# Altium schematic sheet SDcard.SchDoc: Thymio2
size A4; Organization: Original design LSRO-STI-EPFL; Address1: Association Mobsya; Address2: Michael Bonani; Address3: Ch. Closel 3; Address4: CH-1020 Renens; DocumentNumber: 9; Revision: 2.3; SheetNumber: 9; SheetTotal: 9; Engineer: Michael Bonani; Title2: PCB principal; ProjectName: Name of the project
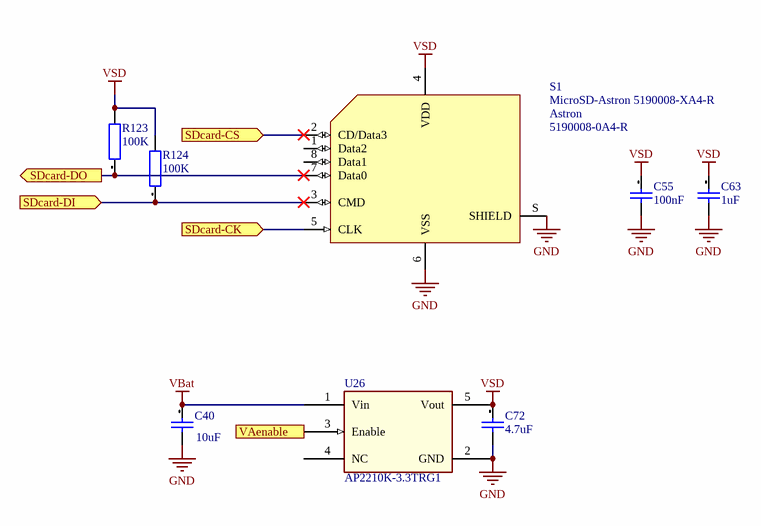
[diagram p0: SDcard.SchDoc]

## Parts
C40  10uF  [CAPC1005X05N]
C55  100nF  [CAPC1005X05N]
C63  1uF  [CAPC1005X05N]
C72  4.7uF  [CAPC1005X05N]
R123  100K  [RESC1005X04N]
R124  100K  [RESC1005X04N]
S1  MicroSD-Astron 5190008-XA4-R  Manufacturer: Astron  MFG Part Number: 5190008-0A4-R  [Astron 5190008-XA4-R]
U26  AP2210K-3.3TRG1  [SOT95P285X100-5N]

## Ports
SDcard-CK (in), SDcard-CS (in), SDcard-DI (in), SDcard-DO (out), VAenable (in)

## Nets
GND: C40.2 C55.2 C63.2 C72.2 S1.6(VSS) S1.S(SHIELD) U26.2(GND)
VBat: C40.1 U26.1(Vin)
VSD: C55.1 C63.1 C72.1 R123.2 R124.2 S1.4(VDD) U26.5(Vout)
SDcard-CK: S1.5(CLK) ; port SDcard-CK
SDcard-CS: S1.2(CD/Data3) ; port SDcard-CS
SDcard-DI: R124.1 S1.3(CMD) ; port SDcard-DI
SDcard-DO: R123.1 S1.7(Data0) ; port SDcard-DO
VAenable: U26.3(Enable) ; port VAenable

Not connected (* = marked no-connect by the designer): S1 1(Data2) 8(Data1); U26 4(NC)

## Notes on the sheet
- Date:
- Project
- Part
- Revision:
- File :
- Page
- de

## Library data of the parts
C40 C72 = 4.7uF[[/\]]0603[[/\]]1: Capacitor; Manufacturer: Kemet; Manufacturer Nr: C0603C475K9PAC; Preference: 1; Tolerance +: +10; Tolerance -: -10; Dielectric: X5R; Voltage: 6.3; MaxTemperature: +85; MinTemperature: -55; Quant_1: 10; Quant_2: 100; Quant_3: 1000; Quant_4: 4000; Currentie: CHF; LayerSch: Top; Size: 0603; Footprint Acort: 0603_G; Supplier: Farnell; Supplier Nr: 9227784; ComponentLink2Description: Farnell link; ComponentLink2URL: http://ch.farnell.com/jsp/displayProduct.jsp?sku=9227784; Price_1: 0.33; Price_2: 0.298; Price_3: 0.278; Price_4: 0.246; ROHS: True; DateLastUpdate: 2007-12-03 / 14:22:57
C55 = 100nF[[/\]]0603[[/\]]1: Capacitor; Manufacturer: Kemet; Manufacturer Nr: C0603C104K5RAC; Preference: 1; Tolerance +: +10; Tolerance -: -10; Dielectric: X7R; Voltage: 50; MaxTemperature: +125; MinTemperature: -55; Quant_1: 10; Quant_2: 100; Quant_3: 1000; Quant_4: 4000; Currentie: CHF; Size: 0603; Footprint Acort: 0603_G; Supplier: Farnell; Supplier Nr: 1288255; ComponentLink2Description: Farnell link; ComponentLink2URL: http://ch.farnell.com/jsp/displayProduct.jsp?sku=1288255; Price_1: 0.046; Price_2: 0.04; Price_3: 0.037; Price_4: 0.036; ROHS: True; DateLastUpdate: 2007-12-03 / 14:22:31
C63 = 1uF[[/\]]0603[[/\]]1: Capacitor; Manufacturer: Murata; Manufacturer Nr: GRM188R61E105K; Preference: 1; Tolerance +: +10; Tolerance -: -10; Dielectric: X5R; Voltage: 25; MaxTemperature: +85; MinTemperature: -55; Quant_1: 10; Quant_2: 100; Quant_3: 500; Currentie: CHF; Size: 0603; Footprint Acort: 0603_G; Supplier: Distrelec; Supplier Nr: 823495; ComponentLink2Description: Distrelec link; ComponentLink2URL: http://www.distrelec.com/ishopWebFront/search/luceneSearch.do?dispatch=find&showImage=on&artnrPhrase=823495; Price_1: 0.1797; Price_2: 0.1474; Price_3: 0.1162; ROHS: True; DateLastUpdate: 2007-12-03 / 14:22:46
R123 R124 = 100K[[/\]]0603[[/\]]1: Resistor; Manufacturer: Vishay; Manufacturer Nr: D11CRCW06030B1003F; Tolerance: +/-1; Preference: 1; Power: 0.1; Voltage: 75; Current: 1.5; ppm/K: +/-100; Quant_1: 10; Quant_2: 100; Quant_3: 500; Currentie: CHF; Size: 0603; Footprint Acort: 0603; ComponentLink1Description: OnLine datasheet; Supplier: Distrelec; Supplier Nr: 715636; ComponentLink2Description: Distrelec link; ComponentLink2URL: http://www.distrelec.com/ishopWebFront/search/luceneSearch.do?dispatch=find&showImage=on&artnrPhrase=715636; ROHS: True; Price_1: 0.0538; Price_2: 0.0323; Price_3: 0.0204; DateLastUpdate: 2007-12-03 / 16:29:58
S1 = SD-Card-Micro-ASLTRON 5190008-XA4-R: MicroSD Card connector 5190008-XA4-R; LayerSch: Top
U26 = AP7331: 300mA, Low Quiescent Current, Fast Transient LDO; LayerSch: Top